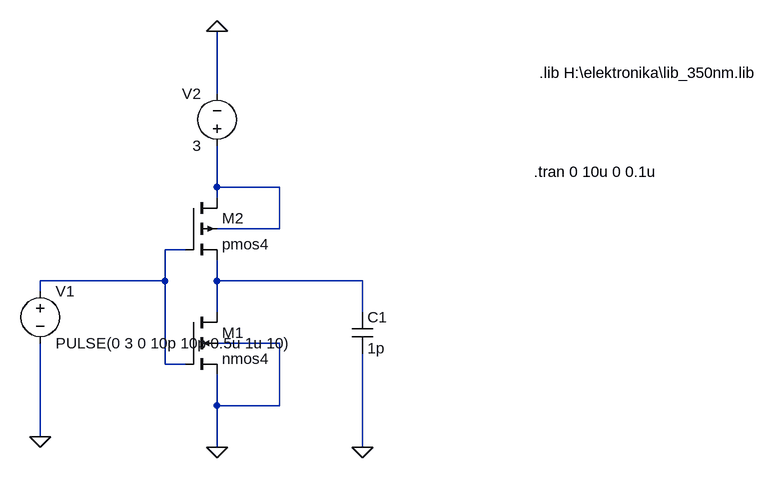
[diagram p0: schematic invertor.asc]
invertor.asc, the LTspice schematic file:
Version 4
SHEET 1 880 680
WIRE -80 -96 -80 -192
WIRE -80 48 -80 -16
WIRE 16 48 -80 48
WIRE -80 64 -80 48
WIRE 16 112 16 48
WIRE 16 112 -80 112
WIRE -128 144 -160 144
WIRE -160 192 -160 144
WIRE -160 192 -352 192
WIRE -80 192 -80 160
WIRE 144 192 -80 192
WIRE -352 208 -352 192
WIRE -80 240 -80 192
WIRE 144 240 144 192
WIRE 16 288 -80 288
WIRE -160 320 -160 192
WIRE -128 320 -160 320
WIRE -80 384 -80 336
WIRE 16 384 16 288
WIRE 16 384 -80 384
WIRE -352 432 -352 288
WIRE -80 448 -80 384
WIRE 144 448 144 304
FLAG -352 432 0
FLAG -80 448 0
FLAG -80 -192 0
FLAG 144 448 0
SYMBOL voltage -352 192 R0
WINDOW 123 0 0 Left 2
WINDOW 39 0 0 Left 2
SYMATTR InstName V1
SYMATTR Value PULSE(0 3 0 10p 10p 0.5u 1u 10)
SYMBOL voltage -80 0 R180
WINDOW 0 24 96 Left 2
WINDOW 3 24 16 Left 2
WINDOW 123 0 0 Left 2
WINDOW 39 0 0 Left 2
SYMATTR InstName V2
SYMATTR Value 3
SYMBOL nmos4 -128 240 R0
SYMATTR InstName M1
SYMATTR Value nmos4
SYMATTR Value2 l=0.5u w=50u
SYMBOL pmos4 -128 64 R0
SYMATTR InstName M2
SYMATTR Value pmos4
SYMATTR Value2 l=0.5u w=174u
SYMBOL cap 128 240 R0
SYMATTR InstName C1
SYMATTR Value 1p
TEXT 416 -128 Left 2 !.lib H:\\elektronika\\lib_350nm.lib
TEXT 408 24 Left 2 !.tran 0 10u 0 0.1u

The netlist it stands for:
* invertor.asc
V1 N002 0 PULSE(0 3 0 10p 10p 0.5u 1u 10)
V2 N001 0 3
M1 N003 N002 0 0 nmos4 l=0.5u w=50u
M2 N001 N002 N003 N001 pmos4 l=0.5u w=174u
C1 N003 0 1p
.model NMOS NMOS
.model PMOS PMOS
.lib standard.mos
.lib H:\elektronika\lib_350nm.lib
.tran 0 10u 0 0.1u
.backanno
.end